# EAGLE design BreakoutBoard_RevA (EAGLE 6.0)
AUTHOR: Sandor Szilvasi; AUTHOREMAIL: sandor.szilvasi@vanderbilt.edu; COPYRIGHT: Copyright © 2011 Vanderbilt University, ISIS; PAGE1: Cover Page; PAGE2: General Breakout; PAGE3: Power Board Specific; REVISION: A; TITLE: Breakout Board; VERIFIER: Peter Volgyesi; VERIFIEREMAIL: peter.volgyesi@vanderbilt.edu

## Sheet 1 of 3
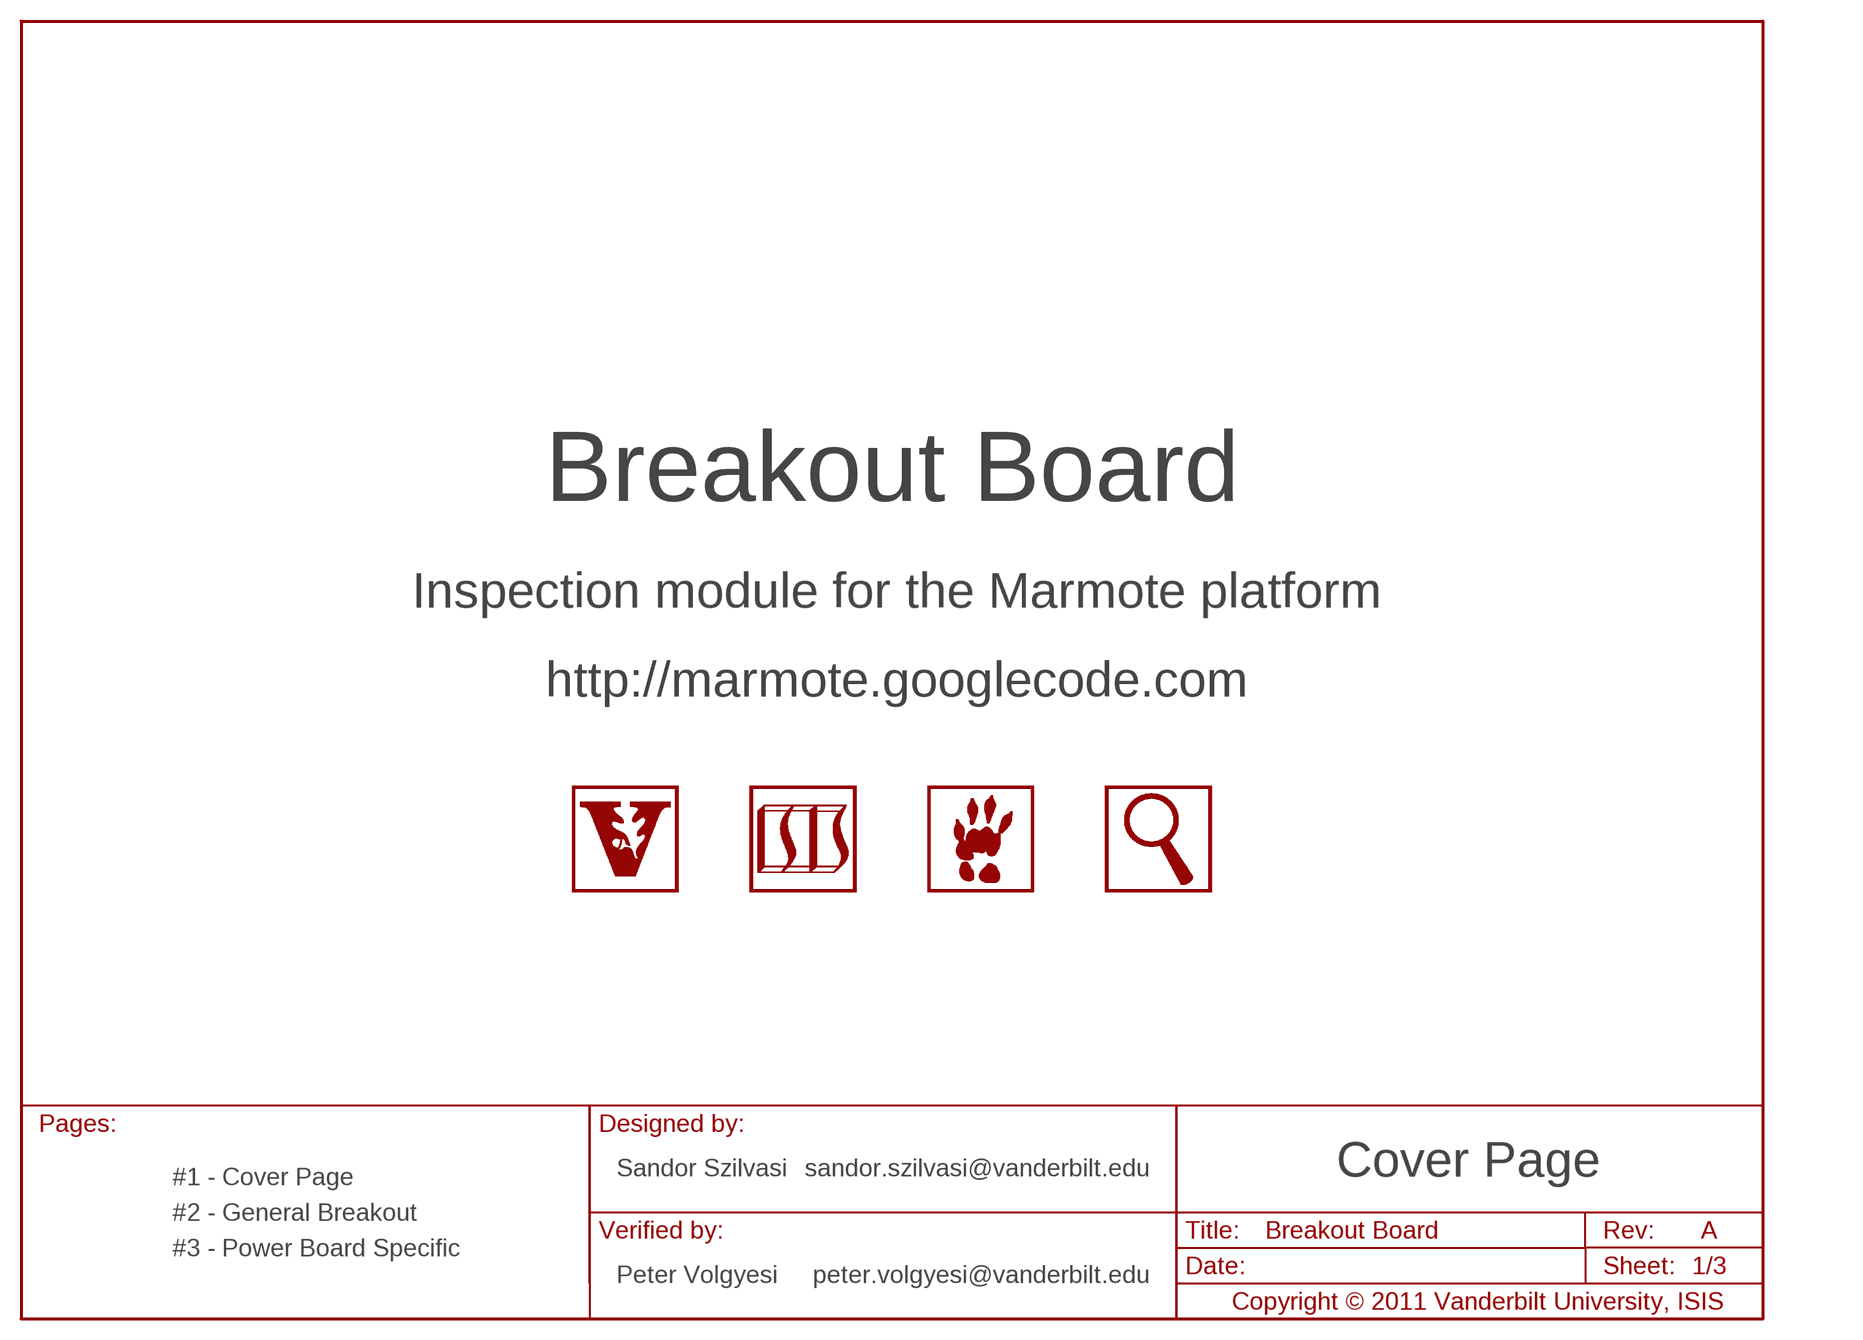
[diagram p0: schematic, sheet 1]

### Parts
LOGO1  LOGO-ISIS-600MIL-10MM-AU  [LOGO-ISIS-10MM-GOLD]
LOGO2  LOGO-VANDERBILT-600MIL-10MM-AU  [LOGO-VANDERBILT-10MM-GOLD]
LOGO3  LOGO-MARMOTE-600MIL-10MM-AU  [LOGO-MARMOTE-10MM-GOLD]
LOGO4  LOGO-MAGNIFYING-GLASS-600MIL-10MM-AU  [LOGO-MAGNIFYING-GLASS-10MM-GOLD]

### Notes on the sheet
- Inspection module for the Marmote platform
- http://marmote.googlecode.com

## Sheet 2 of 3
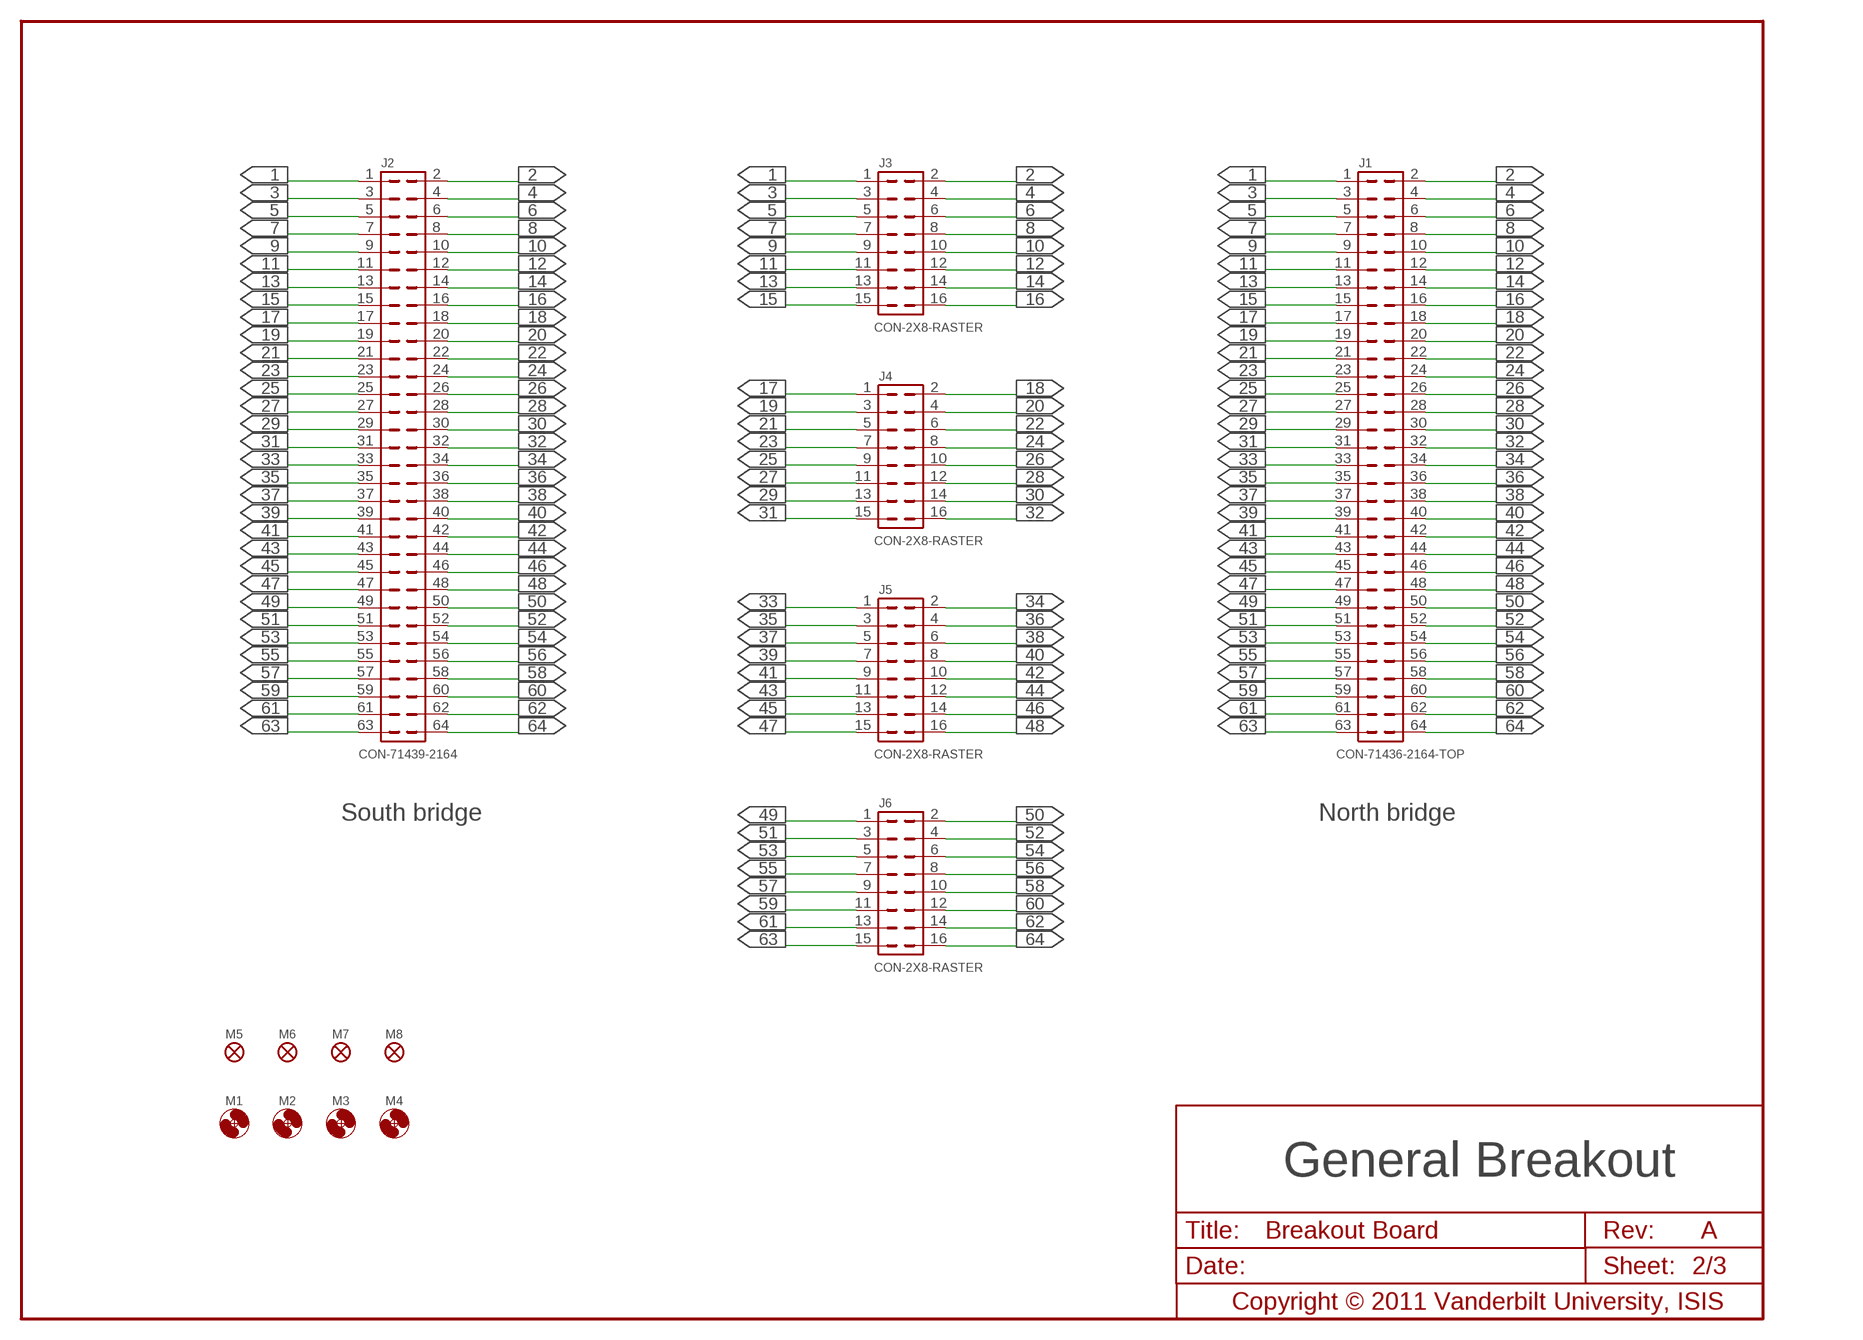
[diagram p1: schematic, sheet 2]

### Parts
J1  CON-71436-2164-TOP  [71436-XX64]
J2  CON-71439-2164  [71439-XX64-BOT]
J3  CON-2X8-RASTER  [2X16]
J4  CON-2X8-RASTER  [2X16]
J5  CON-2X8-RASTER  [2X16]
J6  CON-2X8-RASTER  [2X16]
M1  MOUNT-HOLE3.3  [3,3]
M2  MOUNT-HOLE3.3  [3,3]
M3  MOUNT-HOLE3.3  [3,3]
M4  MOUNT-HOLE3.3  [3,3]
M5  FIDUCIAL1X2  [FIDUCIAL-1X2]
M6  FIDUCIAL1X2  [FIDUCIAL-1X2]
M7  FIDUCIAL1X2  [FIDUCIAL-1X2]
M8  FIDUCIAL1X2  [FIDUCIAL-1X2]

### Nets
1: J1.1 J2.1 J3.1 ; also sheet 3
2: J1.2 J2.2 J3.2 ; also sheet 3
3: J1.3 J2.3 J3.3
4: J1.4 J2.4 J3.4 ; also sheet 3
5: J1.5 J2.5 J3.5
6: J1.6 J2.6 J3.6 ; also sheet 3
7: J1.7 J2.7 J3.7
8: J1.8 J2.8 J3.8 ; also sheet 3
9: J1.9 J2.9 J3.9
10: J1.10 J2.10 J3.10
11: J1.11 J2.11 J3.11
12: J1.12 J2.12 J3.12
13: J1.13 J2.13 J3.13
14: J1.14 J2.14 J3.14
15: J1.15 J2.15 J3.15
16: J1.16 J2.16 J3.16
17: J1.17 J2.17 J4.1
18: J1.18 J2.18 J4.2
19: J1.19 J2.19 J4.3
20: J1.20 J2.20 J4.4
21: J1.21 J2.21 J4.5
22: J1.22 J2.22 J4.6
23: J1.23 J2.23 J4.7
24: J1.24 J2.24 J4.8
25: J1.25 J2.25 J4.9
26: J1.26 J2.26 J4.10
27: J1.27 J2.27 J4.11
28: J1.28 J2.28 J4.12
29: J1.29 J2.29 J4.13
30: J1.30 J2.30 J4.14 ; also sheet 3
31: J1.31 J2.31 J4.15
32: J1.32 J2.32 J4.16 ; also sheet 3
33: J1.33 J2.33 J5.1
34: J1.34 J2.34 J5.2 ; also sheet 3
35: J1.35 J2.35 J5.3
36: J1.36 J2.36 J5.4 ; also sheet 3
37: J1.37 J2.37 J5.5
38: J1.38 J2.38 J5.6 ; also sheet 3
39: J1.39 J2.39 J5.7
40: J1.40 J2.40 J5.8
41: J1.41 J2.41 J5.9
42: J1.42 J2.42 J5.10
43: J1.43 J2.43 J5.11
44: J1.44 J2.44 J5.12
45: J1.45 J2.45 J5.13
46: J1.46 J2.46 J5.14
47: J1.47 J2.47 J5.15
48: J1.48 J2.48 J5.16
49: J1.49 J2.49 J6.1
50: J1.50 J2.50 J6.2
51: J1.51 J2.51 J6.3
52: J1.52 J2.52 J6.4
53: J1.53 J2.53 J6.5
54: J1.54 J2.54 J6.6
55: J1.55 J2.55 J6.7
56: J1.56 J2.56 J6.8
57: J1.57 J2.57 J6.9
58: J1.58 J2.58 J6.10
59: J1.59 J2.59 J6.11
60: J1.60 J2.60 J6.12 ; also sheet 3
61: J1.61 J2.61 J6.13
62: J1.62 J2.62 J6.14 ; also sheet 3
63: J1.63 J2.63 J6.15 ; also sheet 3
64: J1.64 J2.64 J6.16 ; also sheet 3

### Notes on the sheet
- South bridge | North bridge

## Sheet 3 of 3
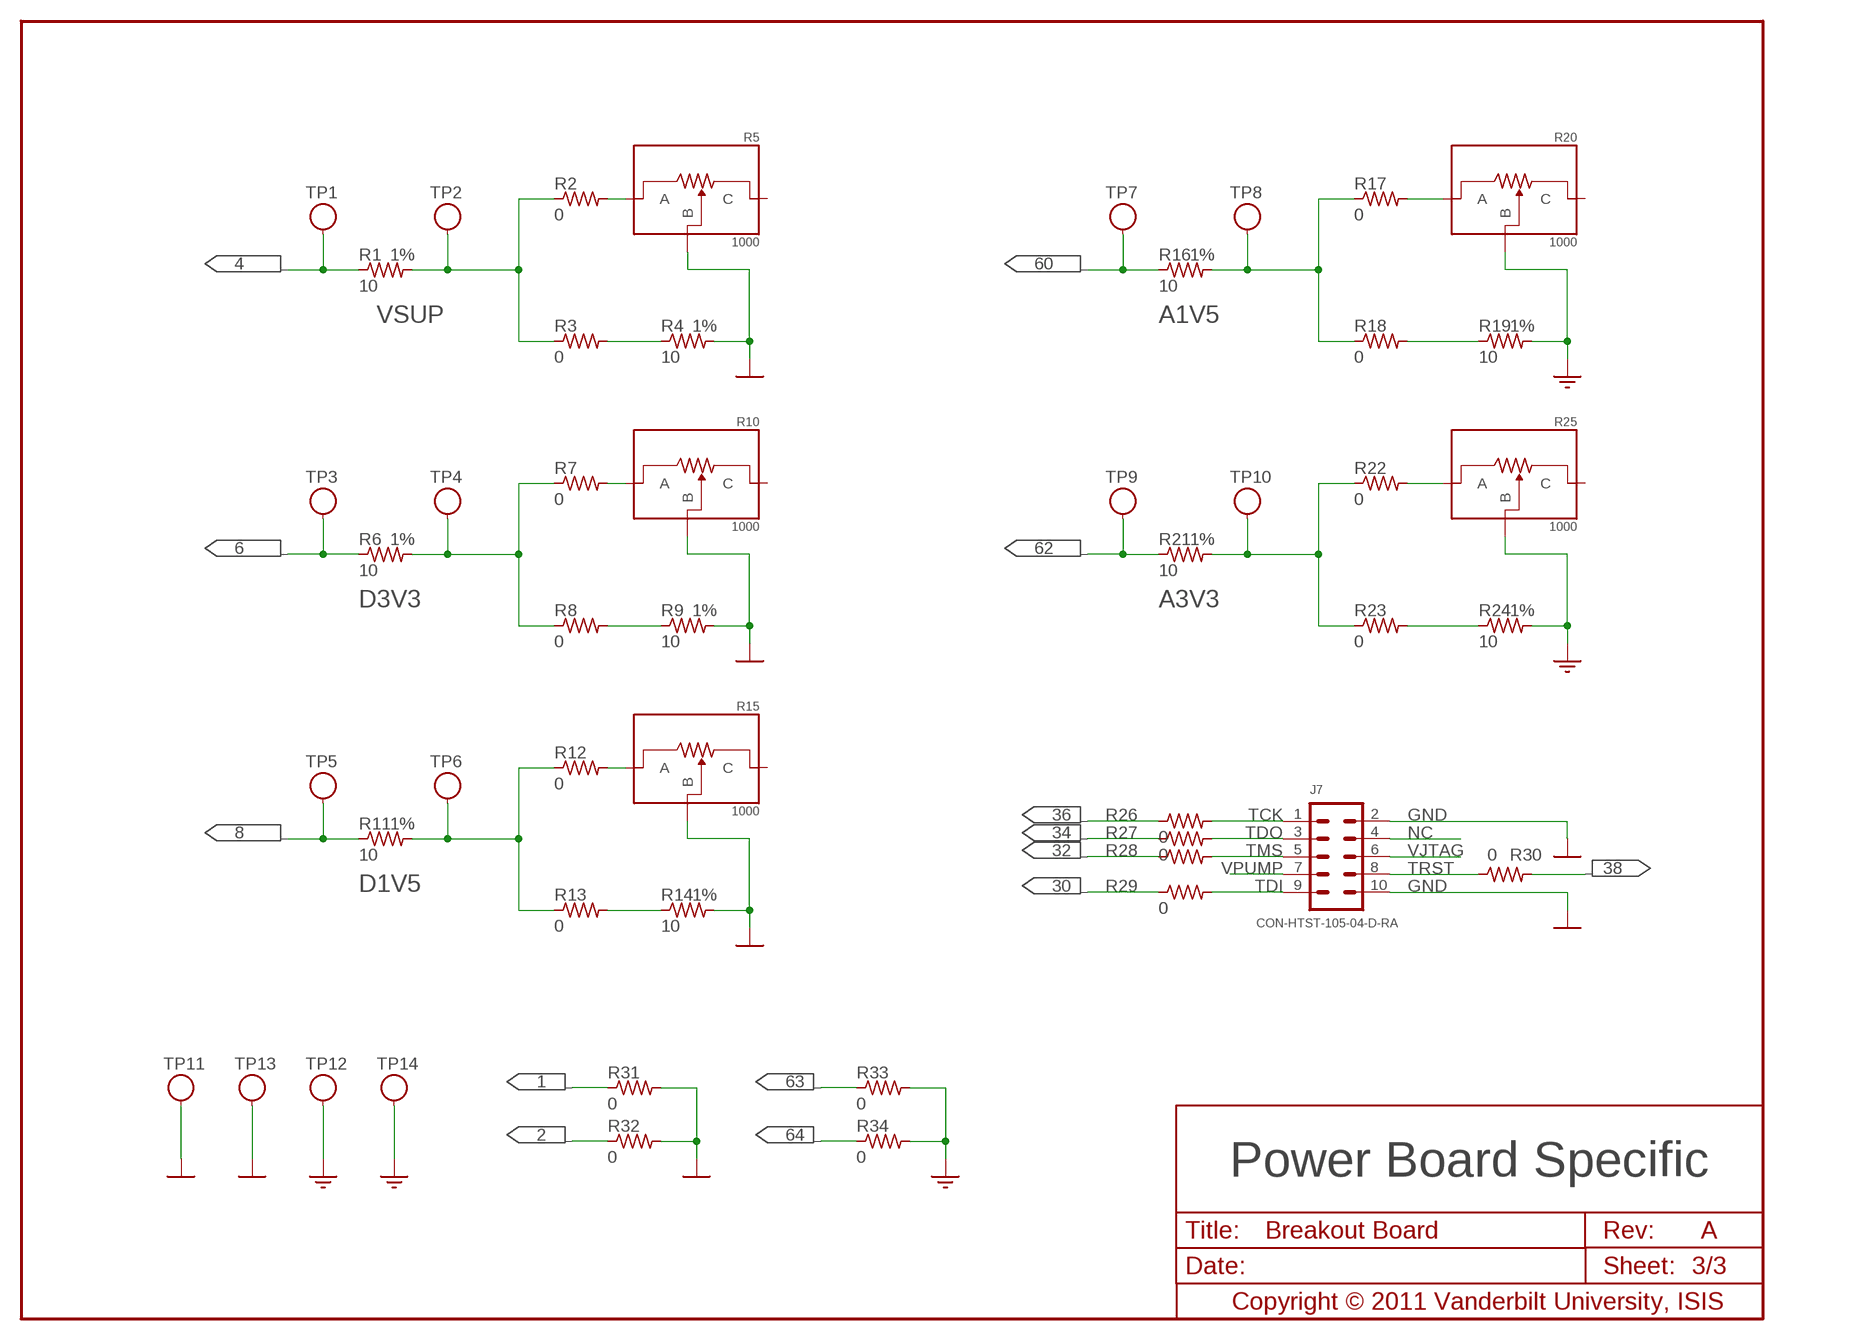
[diagram p2: schematic, sheet 3]

### Parts
J7  CON-HTST-105-04-D-RA  [HTST-105-04-D-RA]
R1  10  R0805  [R0805]
R2  0  R0805  [R0805]
R3  0  R0805  [R0805]
R4  10  R0805  [R0805]
R5  1000  TRIMMER  [TRIMMER-3MM]
R6  10  R0805  [R0805]
R7  0  R0805  [R0805]
R8  0  R0805  [R0805]
R9  10  R0805  [R0805]
R10  1000  TRIMMER  [TRIMMER-3MM]
R11  10  R0805  [R0805]
R12  0  R0805  [R0805]
R13  0  R0805  [R0805]
R14  10  R0805  [R0805]
R15  1000  TRIMMER  [TRIMMER-3MM]
R16  10  R0805  [R0805]
R17  0  R0805  [R0805]
R18  0  R0805  [R0805]
R19  10  R0805  [R0805]
R20  1000  TRIMMER  [TRIMMER-3MM]
R21  10  R0805  [R0805]
R22  0  R0805  [R0805]
R23  0  R0805  [R0805]
R24  10  R0805  [R0805]
R25  1000  TRIMMER  [TRIMMER-3MM]
R26  0  R0805  [R0805]
R27  0  R0805  [R0805]
R28  0  R0805  [R0805]
R29  0  R0805  [R0805]
R30  0  R0805  [R0805]
R31  0  R0805  [R0805]
R32  0  R0805  [R0805]
R33  0  R0805  [R0805]
R34  0  R0805  [R0805]
TP1  TESTPOINT-BLUE  [TESTPOINT]
TP2  TESTPOINT-BLUE  [TESTPOINT]
TP3  TESTPOINT-BLUE  [TESTPOINT]
TP4  TESTPOINT-BLUE  [TESTPOINT]
TP5  TESTPOINT-BLUE  [TESTPOINT]
TP6  TESTPOINT-BLUE  [TESTPOINT]
TP7  TESTPOINT-GREEN  [TESTPOINT]
TP8  TESTPOINT-GREEN  [TESTPOINT]
TP9  TESTPOINT-GREEN  [TESTPOINT]
TP10  TESTPOINT-GREEN  [TESTPOINT]
TP11  TESTPOINT-YELLOW  [TESTPOINT]
TP12  TESTPOINT-YELLOW  [TESTPOINT]
TP13  TESTPOINT-YELLOW  [TESTPOINT]
TP14  TESTPOINT-YELLOW  [TESTPOINT]

### Nets
1: R31.1 ; also sheet 2
2: R32.1 ; also sheet 2
4: R1.1 TP1.1 ; also sheet 2
6: R6.1 TP3.1 ; also sheet 2
8: R11.1 TP5.1 ; also sheet 2
30: R29.1 ; also sheet 2
32: R28.1 ; also sheet 2
34: R27.1 ; also sheet 2
36: R26.1 ; also sheet 2
38: R30.2 ; also sheet 2
60: R16.1 TP7.1 ; also sheet 2
62: R21.1 TP9.1 ; also sheet 2
63: R33.1 ; also sheet 2
64: R34.1 ; also sheet 2
A1V5-: R16.2 R17.1 R18.1 TP8.1
A3V3-: R21.2 R22.1 R23.1 TP10.1
AGND: R19.2 R20.2(B) R24.2 R25.2(B) R33.2 R34.2 TP12.1 TP14.1
D1V5-: R11.2 R12.1 R13.1 TP6.1
D3V3-: R6.2 R7.1 R8.1 TP4.1
DGND: J7.2 J7.10 R4.2 R5.2(B) R9.2 R10.2(B) R14.2 R15.2(B) R31.2 R32.2 TP11.1 TP13.1
N$4: R7.2 R10.1(A)
N$5: R8.2 R9.1
N$8: R12.2 R15.1(A)
N$9: R18.2 R19.1
N$10: R17.2 R20.1(A)
N$11: R22.2 R25.1(A)
N$13: R2.2 R5.1(A)
N$14: R3.2 R4.1
N$15: R13.2 R14.1
N$16: R23.2 R24.1
NC: J7.4
TCK: J7.1 R26.2
TDI: J7.9 R29.2
TDO: J7.3 R27.2
TMS: J7.5 R28.2
TRST: J7.8 R30.1
VJTAG: J7.6
VPUMP: J7.7
VSUP-: R1.2 R2.1 R3.1 TP2.1
Unconnected: R5.3(C) R10.3(C) R15.3(C) R20.3(C) R25.3(C)

### Notes on the sheet
- VSUP | A1V5
- D3V3 | A3V3
- GND
- D1V5 | GND

## Library data of the parts
J1 = BreakoutBoard:CON-71436: Board-to-Board Connector 1.00mm (.039") Mezzanine IEEE 1386 Plug - Dual Row 64-pin, SMT, Vertical Stacking Source: http://www.molex.com/product/micro/71436.html; DIGI-KEY#: WM17200-ND; MF: Molex; MPN: 71436-2164
J2 = BreakoutBoard:CON-71439: Board-to-Board Connector 1.00mm (.039") Mezzanine IEEE 1386 Receptacle - Dual Row 64-pin, SMT, Vertical Stacking Source: http://www.molex.com/molex/products/datasheet.jsp?part=active/0714392164_PCB_RECEPTACLES.xml&channel=Products; DIGI-KEY#: WM17222-ND; MATED-STACKING-HEIGHT: 13mm; MF: Molex; MPN: 71439-2164
J3-J6 = BreakoutBoard:CON-2X8-RASTER
J7 = BreakoutBoard:CON-HTST-105-04: 2x5 pin Through-hole .025" SQ Post Header Source: Datasheet <http://media.digikey.com/PDF/Data%20Sheets/Samtec/TSS,TST,HTSS,HTST,ZSS,ZST_Series.pdf>
LOGO1 = Logo:LOGO-ISIS-600MIL: ISIS Logo Official logo of the Institute for Software Integrated Systems (ISIS), Vanderbilt as of 2011 Generated from 360 x 360 px bitmap and scaled to 600 x 600 mil v1.0 Initial design
LOGO2 = Logo:LOGO-VANDERBILT-600MIL: Vanderbilt Logo Official Framed Vanderbilt Logo Generated from 360 x 360 px bitmap and scaled to 600 x 600 mil v1.1 Source bitmap smoothened v1.0 Initial design
LOGO3 = Logo:LOGO-MARMOTE-600MIL: Marmote Platform Logo Preliminary logo for the Marmote Platform (http://marmote.googlecode.com) Generated from 360 x 360 px bitmap and scaled to 600 x 600 mil v1.1 Source bitmap smoothened v1.0 Initial design
LOGO4 = Logo:LOGO-MAGNIFYING-GLASS-600MIL: Magnifying Glass Logo Logo for the breakout board of the Marmote platform. Generated from 360 x 360 px bitmap and scaled to 600 x 600 mil. v1.0 Initial design
M1-M4 = powerboard:MOUNT-HOLE: MOUNTING HOLE with drill center marker
M5-M8 = powerboard:FIDUCIAL: Fiducial Alignment Points Various fiducial points for machine vision alignment.
R1 R4 R6 R9 R11 R14 R16 R19 R21 R24 = BreakoutBoard:R: RESISTOR; TOLERANCE: 1%
R2 R3 R7 R8 R12 R13 R17 R18 R22 R23 R26-R34 = BreakoutBoard:R: RESISTOR
R5 R10 R15 R20 R25 = BreakoutBoard:TRIMMER: Panasonic EVM series SMT trimmer; DIGI-KEY#: P3W102CT-ND; MF: Panasonic - ECG; MPN: EVM-3WSX80B13
TP1-TP6 = BreakoutBoard:TESTPOINT: Test Point Keystone compact through hole mount test point for SUPPLY and GROUND signals Terminal: .015 (.38) × .032 (.81) thick Phosphor Bronze Wire, Silver Plate Base: Nylon 46, UL Rated 94V-0 Mtg. Hole: .063 (1.6) Diameter Source: http://www.keyelco.com/pdfs/M55p51.pdf; DIGI-KEY#: 5122K-ND; MF: Keystone; MPN: 5122
TP7-TP10 = BreakoutBoard:TESTPOINT: Test Point Keystone compact through hole mount test point for SUPPLY and GROUND signals Terminal: .015 (.38) × .032 (.81) thick Phosphor Bronze Wire, Silver Plate Base: Nylon 46, UL Rated 94V-0 Mtg. Hole: .063 (1.6) Diameter Source: http://www.keyelco.com/pdfs/M55p51.pdf; DIGI-KEY#: 5121K-ND; MF: Keystone; MPN: 5121
TP11-TP14 = BreakoutBoard:TESTPOINT: Test Point Keystone compact through hole mount test point for SUPPLY and GROUND signals Terminal: .015 (.38) × .032 (.81) thick Phosphor Bronze Wire, Silver Plate Base: Nylon 46, UL Rated 94V-0 Mtg. Hole: .063 (1.6) Diameter Source: http://www.keyelco.com/pdfs/M55p51.pdf; DIGI-KEY#: 5009K-ND; MF: Keystone; MPN: 5009

## Board
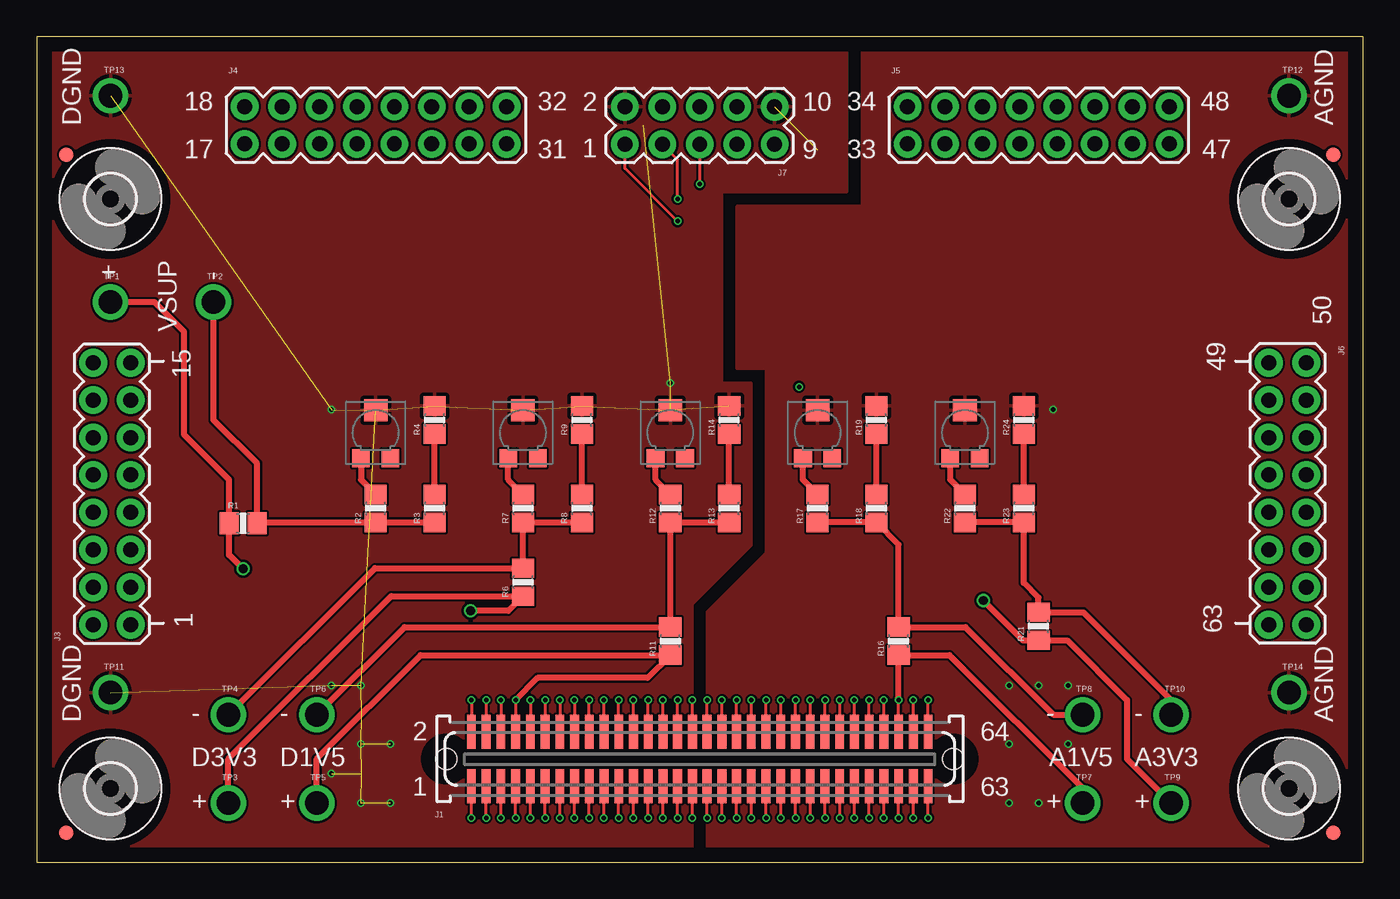
[diagram p3: board, top side]
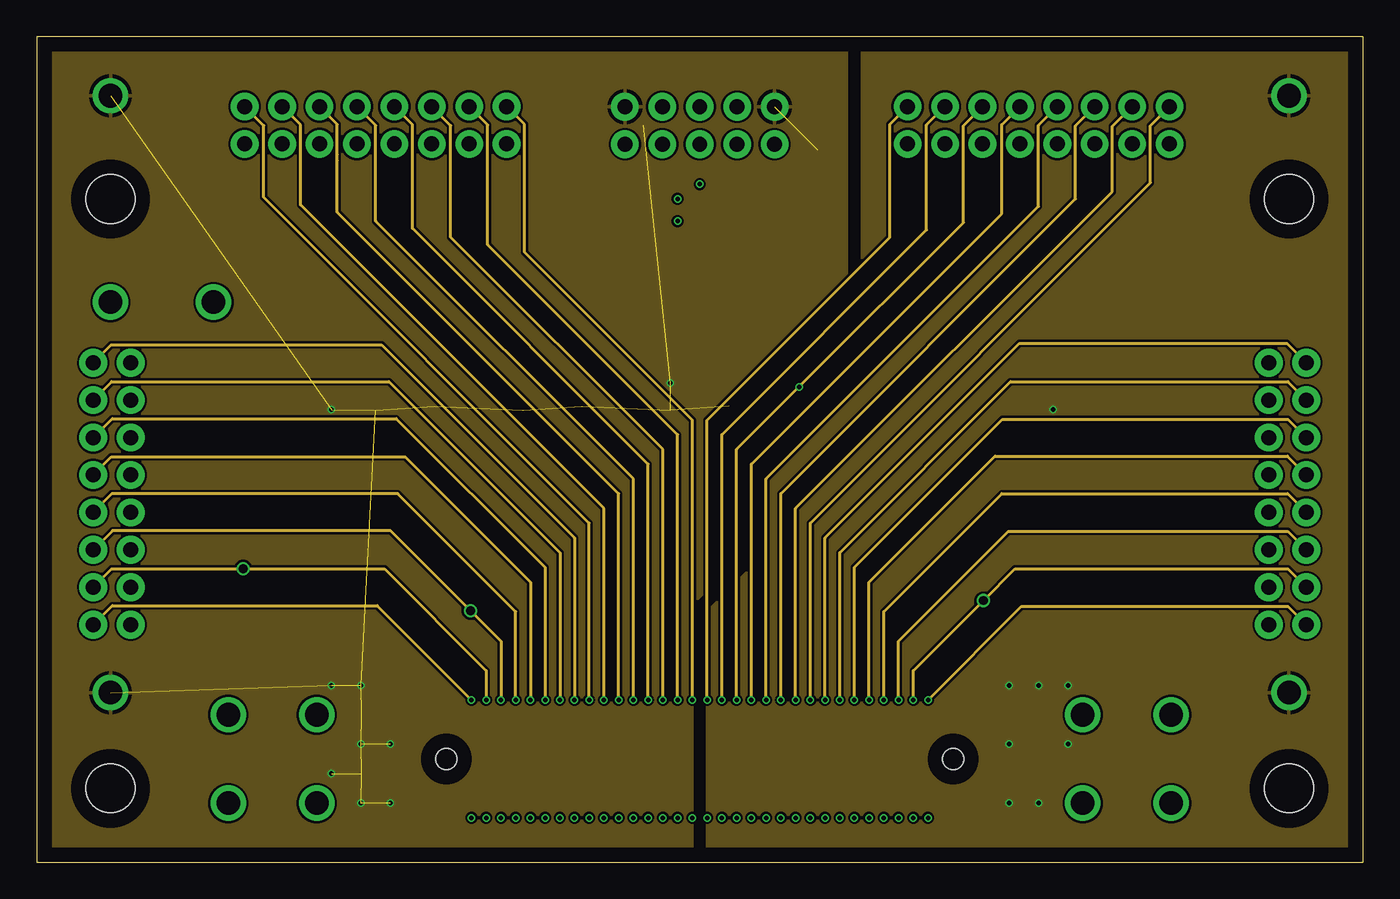
[diagram p4: board, inner layer Even]
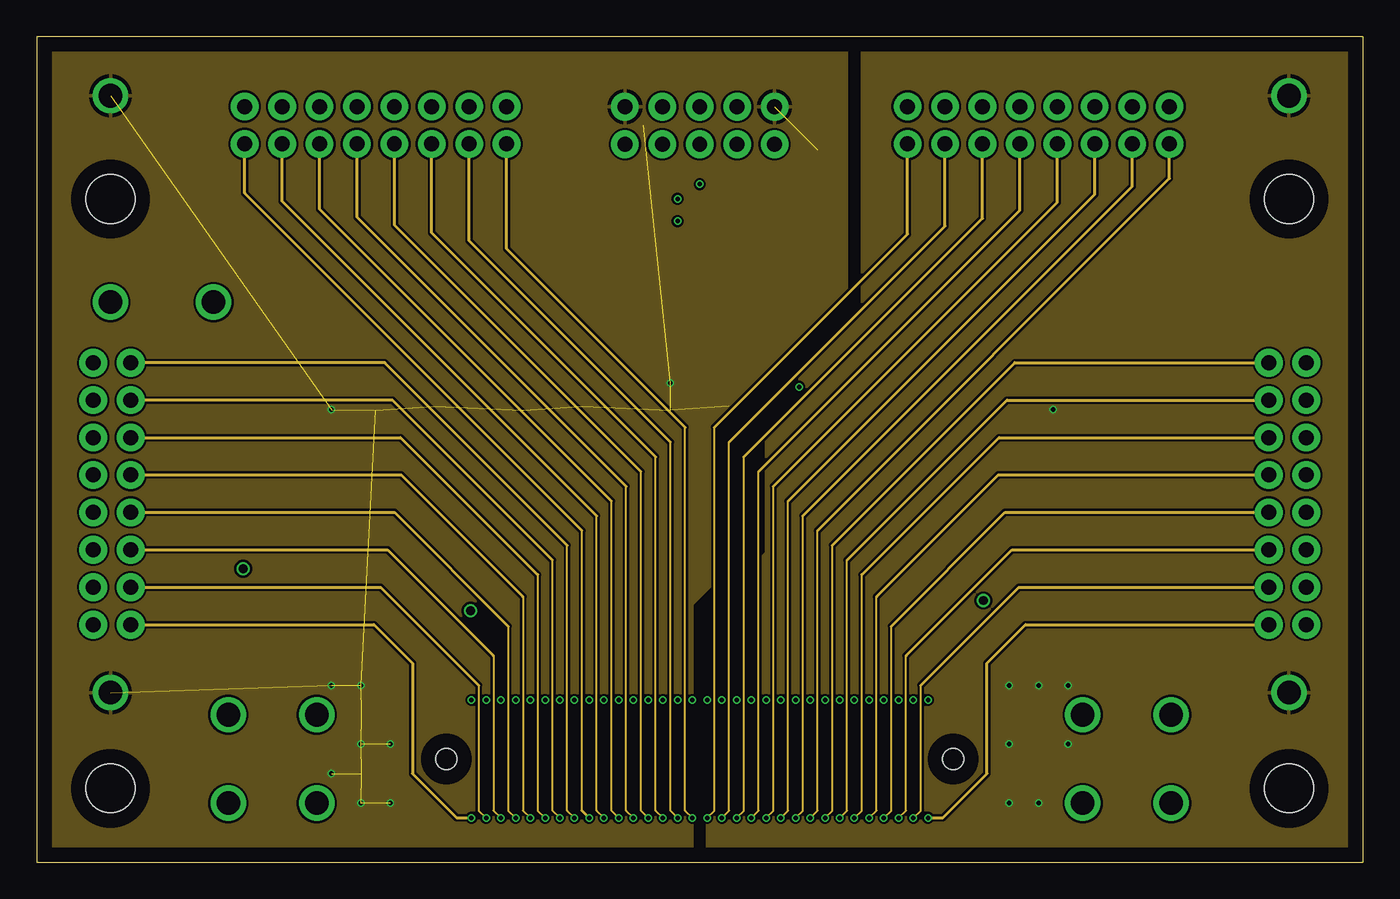
[diagram p5: board, inner layer Odd]
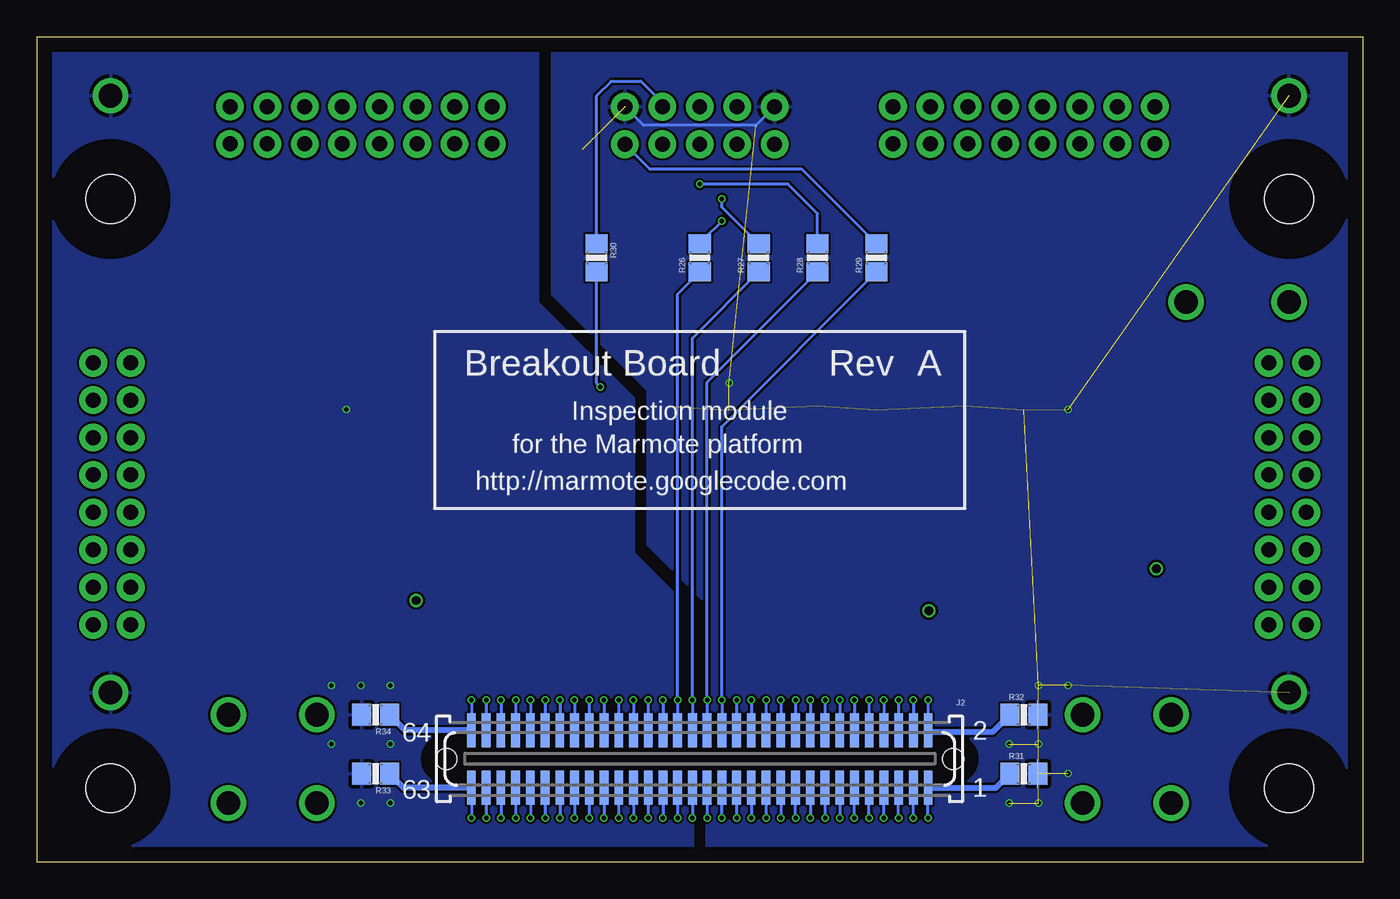
[diagram p6: board, bottom side, seen from below]

Size 90 x 56 mm. Coordinates in mm from the lower left corner, seen from the top.
Outline: 0,56 0,0 90,0 90,56 0,56
Copper layers (1*2+3*16): Top 0.0356mm / dielectric 8mil / Even 0.0356mm / dielectric 39mil / Odd 0.0356mm / dielectric 8mil / Bottom 0.0356mm
Design rules: minimum track width 6mil, minimum drill 12mil, track to track 6mil, track to pad 6mil, pad to pad 6mil, via to via 6mil, smd to smd 6mil, copper to edge 40mil, drill to drill 8mil, minimum pad ring 10mil, minimum via ring 4mil, stop-mask expansion 0mil, vias tented up to drill 8mil, thermal gap 10mil

### Footprints (pad centres in the part's own frame; a part is rotated, then mirrored left to right if it is on the bottom)
71436-XX64 = smd 0.6 x 2.3: 1 -15.5,-1.85; 2 -15.5,1.85; 3 -14.5,-1.85; 4 -14.5,1.85; 5 -13.5,-1.85; 6 -13.5,1.85; 7 -12.5,-1.85; 8 -12.5,1.85; 9 -11.5,-1.85; 10 -11.5,1.85; 11 -10.5,-1.85; 12 -10.5,1.85; 13 -9.5,-1.85; 14 -9.5,1.85; 15 -8.5,-1.85; 16 -8.5,1.85; 17 -7.5,-1.85; 18 -7.5,1.85; 19 -6.5,-1.85; 20 -6.5,1.85; 21 -5.5,-1.85; 22 -5.5,1.85; 23 -4.5,-1.85; 24 -4.5,1.85; 25 -3.5,-1.85; 26 -3.5,1.85; 27 -2.5,-1.85; 28 -2.5,1.85; 29 -1.5,-1.85; 30 -1.5,1.85; 31 -0.5,-1.85; 32 -0.5,1.85; 33 0.5,-1.85; 34 0.5,1.85; 35 1.5,-1.85; 36 1.5,1.85; 37 2.5,-1.85; 38 2.5,1.85; 39 3.5,-1.85; 40 3.5,1.85; 41 4.5,-1.85; 42 4.5,1.85; 43 5.5,-1.85; 44 5.5,1.85; 45 6.5,-1.85; 46 6.5,1.85; 47 7.5,-1.85; 48 7.5,1.85; 49 8.5,-1.85; 50 8.5,1.85; 51 9.5,-1.85; 52 9.5,1.85; 53 10.5,-1.85; 54 10.5,1.85; 55 11.5,-1.85; 56 11.5,1.85; 57 12.5,-1.85; 58 12.5,1.85; 59 13.5,-1.85; 60 13.5,1.85; 61 14.5,-1.85; 62 14.5,1.85; 63 15.5,-1.85; 64 15.5,1.85 | hole 1.4: -17.2,0; 17.2,0
71439-XX64-BOT = smd 0.6 x 2.3: 1 -15.5,1.96; 2 -15.5,-1.96; 3 -14.5,1.96; 4 -14.5,-1.96; 5 -13.5,1.96; 6 -13.5,-1.96; 7 -12.5,1.96; 8 -12.5,-1.96; 9 -11.5,1.96; 10 -11.5,-1.96; 11 -10.5,1.96; 12 -10.5,-1.96; 13 -9.5,1.96; 14 -9.5,-1.96; 15 -8.5,1.96; 16 -8.5,-1.96; 17 -7.5,1.96; 18 -7.5,-1.96; 19 -6.5,1.96; 20 -6.5,-1.96; 21 -5.5,1.96; 22 -5.5,-1.96; 23 -4.5,1.96; 24 -4.5,-1.96; 25 -3.5,1.96; 26 -3.5,-1.96; 27 -2.5,1.96; 28 -2.5,-1.96; 29 -1.5,1.96; 30 -1.5,-1.96; 31 -0.5,1.96; 32 -0.5,-1.96; 33 0.5,1.96; 34 0.5,-1.96; 35 1.5,1.96; 36 1.5,-1.96; 37 2.5,1.96; 38 2.5,-1.96; 39 3.5,1.96; 40 3.5,-1.96; 41 4.5,1.96; 42 4.5,-1.96; 43 5.5,1.96; 44 5.5,-1.96; 45 6.5,1.96; 46 6.5,-1.96; 47 7.5,1.96; 48 7.5,-1.96; 49 8.5,1.96; 50 8.5,-1.96; 51 9.5,1.96; 52 9.5,-1.96; 53 10.5,1.96; 54 10.5,-1.96; 55 11.5,1.96; 56 11.5,-1.96; 57 12.5,1.96; 58 12.5,-1.96; 59 13.5,1.96; 60 13.5,-1.96; 61 14.5,1.96; 62 14.5,-1.96; 63 15.5,1.96; 64 15.5,-1.96 | hole 1.4: -17.2,0; 17.2,0
2X16 = drill 1.016 pad 1.88: 1 -8.89,-1.27; 2 -8.89,1.27; 3 -6.35,-1.27; 4 -6.35,1.27; 5 -3.81,-1.27; 6 -3.81,1.27; 7 -1.27,-1.27; 8 -1.27,1.27; 9 1.27,-1.27; 10 1.27,1.27; 11 3.81,-1.27; 12 3.81,1.27; 13 6.35,-1.27; 14 6.35,1.27; 15 8.89,-1.27; 16 8.89,1.27
HTST-105-04-D-RA = drill 1.016 pad 1.88: 1 5.08,2.54; 2 5.08,0; 3 2.54,2.54; 4 2.54,0; 5 0,2.54; 6 0,0; 7 -2.54,2.54; 8 -2.54,0; 9 -5.08,2.54; 10 -5.08,0
3,3 = hole 3.3: 0,0
FIDUCIAL-1X2 = smd 1 x 1: 1 0,0
R0805 = smd 1.3 x 1.5: 1 -0.95,0; 2 0.95,0
TRIMMER-3MM = smd 1.2 x 1.2: 1 -1,-1.6; 3 1,-1.6 | smd 1.6 x 1.5: 2 0,1.65
TESTPOINT = drill 1.6: 1 0,0

### Placement (x,y rotation side)
J1  45,7 0 top
J2  45,7 180 bottom
J3  5.1,25 90 top
J4  23,50 0 top
J5  68,50 0 top
J6  84.9,25 270 top
J7  45,51.25 180 top
LOGO1  32,34 0 top
LOGO2  16,34 0 top
LOGO3  48,34 0 top
LOGO4  64,34 0 top
M1  5,5 0 top
M2  5,45 0 top
M3  85,45 0 top
M4  85,5 0 top
M5  2,2 0 top
M6  2,48 0 top
M7  88,48 0 top
M8  88,2 0 top
R1  14,23 0 top
R2  23,24 90 top
R3  27,24 90 top
R4  27,30 90 top
R5  23,29 0 top
R6  33,19 90 top
R7  33,24 90 top
R8  37,24 90 top
R9  37,30 90 top
R10  33,29 0 top
R11  43,15 90 top
R12  43,24 90 top
R13  47,24 90 top
R14  47,30 90 top
R15  43,29 0 top
R16  58.5,15 90 top
R17  53,24 90 top
R18  57,24 90 top
R19  57,30 90 top
R20  53,29 0 top
R21  68,16 90 top
R22  63,24 90 top
R23  67,24 90 top
R24  67,30 90 top
R25  63,29 0 top
R26  45,41 90 bottom
R27  41,41 90 bottom
R28  37,41 90 bottom
R29  33,41 90 bottom
R30  52,41 270 bottom
R31  23,6 0 bottom
R32  23,10 0 bottom
R33  67,6 180 bottom
R34  67,10 180 bottom
TP1  5,38 0 top
TP2  12,38 0 top
TP3  13,4 0 top
TP4  13,10 0 top
TP5  19,4 0 top
TP6  19,10 0 top
TP7  71,4 0 top
TP8  71,10 0 top
TP9  77,4 0 top
TP10  77,10 0 top
TP11  5,11.5 0 top
TP12  85,52 0 top
TP13  5,52 0 top
TP14  85,11.5 0 top

### Tracks (layer width: path | path; a pad name or v marks a point on that pad's centre or on a via)
1  (via drill 0.3)
  Top 0.203: v29.5,3 J1.1
  Odd 0.203: J3.1 22.89,16.11 25.5,13.5 25.5,6 28.5,3 v29.5,3
  Bottom 0.203: v29.5,3 J2.1
  Bottom 0.406: R31.1 24.91,5.04 J2.1
2  (via drill 0.3)
  Top 0.203: v29.5,11 J1.2
  Even 0.203: J3.2 5.12,17.4 23.1,17.4 v29.5,11
  Bottom 0.203: v29.5,11 J2.2
  Bottom 0.406: R32.1 25.1,8.85 J1.2 J2.2
3  (via drill 0.3)
  Top 0.203: v30.5,3 J1.3
  Odd 0.152: v30.5,3 30,3.5 30,12
  Odd 0.203: J3.3 23.35,18.65 30,12
  Bottom 0.203: v30.5,3 J2.3
4  (via drill 0.3, 0.6)
  Top 0.203: v30.5,11 J1.4
  Top 0.406: TP1.1 8,38 10,36 10,29 13.05,25.95 R1.1 13.05,20.85 v14,19.9
  Even 0.203: J3.4 5.08,19.9 v14,19.9 23.6,19.9 30.5,13 v30.5,11
  Bottom 0.203: v30.5,11 J2.4
5  (via drill 0.3)
  Top 0.203: v31.5,3 J1.5
  Odd 0.152: v31.5,3 31,3.5 31,14
  Odd 0.203: J3.5 23.81,21.19 31,14
  Bottom 0.203: v31.5,3 J2.5
6  (via drill 0.3, 0.6)
  Top 0.203: v31.5,11 J1.6
  Top 0.406: TP3.1 13,7 24.05,18.05 R6.1 32,17.05 v29.45,17.05
  Even 0.203: J3.6 5.14,22.5 24,22.5 v29.45,17.05 31.5,15 v31.5,11
  Bottom 0.203: v31.5,11 J2.6
7  (via drill 0.3)
  Top 0.203: v32.5,3 J1.7
  Odd 0.152: v32.5,3 32,3.5 32,16
  Odd 0.203: J3.7 24.27,23.73 32,16
  Bottom 0.203: v32.5,3 J2.7
8  (via drill 0.3)
  Top 0.203: v32.5,11 J1.8
  Top 0.406: v32.5,11 34,12.5 41.45,12.5 R11.1 26.05,14.05 19,7 TP5.1
  Even 0.203: J3.8 5.1,25 24.5,25 32.5,17 v32.5,11
  Bottom 0.203: v32.5,11 J2.8
9  (via drill 0.3)
  Top 0.203: v33.5,3 J1.9
  Odd 0.152: v33.5,3 33,3.5 33,18
  Odd 0.203: 33,18 24.73,26.27 J3.9
  Bottom 0.203: v33.5,3 J2.9
10  (via drill 0.3)
  Top 0.203: v33.5,11 J1.10
  Even 0.203: J3.10 5.06,27.5 25,27.5 33.5,19 v33.5,11
  Bottom 0.203: v33.5,11 J2.10
11  (via drill 0.3)
  Top 0.203: v34.5,3 J1.11
  Odd 0.152: v34.5,3 34,3.5 34,19.5
  Odd 0.203: 34,19.5 24.69,28.81 J3.11
  Bottom 0.203: v34.5,3 J2.11
12  (via drill 0.3)
  Top 0.203: v34.5,11 J1.12
  Even 0.203: J3.12 5.12,30.1 24.4,30.1 34.5,20 v34.5,11
  Bottom 0.203: v34.5,11 J2.12
13  (via drill 0.3)
  Top 0.203: v35.5,3 J1.13
  Odd 0.152: v35.5,3 35,3.5 35,20.5
  Odd 0.203: 35,20.5 24.15,31.35 J3.13
  Bottom 0.203: J2.13 v35.5,3
14  (via drill 0.3)
  Top 0.203: v35.5,11 J1.14
  Even 0.203: J3.14 5.08,32.6 23.9,32.6 35.5,21 v35.5,11
  Bottom 0.203: v35.5,11 J2.14
15  (via drill 0.3)
  Top 0.203: v36.5,3 J1.15
  Odd 0.152: v36.5,3 36,3.5 36,21.5
  Odd 0.203: 36,21.5 23.61,33.89 J3.15
  Bottom 0.203: J2.15 v36.5,3
16  (via drill 0.3)
  Top 0.203: v36.5,11 J1.16
  Even 0.203: J3.16 5.04,35.1 23.4,35.1 36.5,22 v36.5,11
  Bottom 0.203: v36.5,11 J2.16
17  (via drill 0.3)
  Top 0.203: v37.5,3 J1.17
  Odd 0.152: 37,3.5 37,22.5
  Odd 0.203: v37.5,3 37,3.5 | 37,22.5 14.11,45.39 J4.1
  Bottom 0.203: J2.17 v37.5,3
18  (via drill 0.3)
  Top 0.203: J1.18 v37.5,11
  Even 0.203: v37.5,11 37.5,23 15.4,45.1 15.4,49.98 J4.2
  Bottom 0.203: v37.5,11 J2.18
19  (via drill 0.3)
  Top 0.203: v38.5,3 J1.19
  Odd 0.152: v38.5,3 38,3.5 38,23.5
  Odd 0.203: 38,23.5 16.65,44.85 J4.3
  Bottom 0.203: v38.5,3 J2.19
20  (via drill 0.3)
  Top 0.203: J1.20 v38.5,11
  Even 0.203: v38.5,11 38.5,24 17.9,44.6 17.9,50.02 J4.4
  Bottom 0.203: v38.5,11 J2.20
21  (via drill 0.3)
  Top 0.203: v39.5,3 J1.21
  Odd 0.152: v39.5,3 39,3.5 39,24.5
  Odd 0.203: 39,24.5 19.19,44.31 J4.5
  Bottom 0.203: J2.21 v39.5,3
22  (via drill 0.3)
  Top 0.203: J1.22 v39.5,11
  Even 0.203: v39.5,11 39.5,25 20.4,44.1 20.4,47.6 20.4,48 20.4,50.06 J4.6
  Bottom 0.203: v39.5,11 J2.22
23  (via drill 0.3)
  Top 0.203: v40.5,3 J1.23
  Odd 0.152: v40.5,3 40,3.5 40,25.5
  Odd 0.203: 40,25.5 21.73,43.77 J4.7
  Bottom 0.203: J2.23 v40.5,3
24  (via drill 0.3)
  Top 0.203: J1.24 v40.5,11
  Even 0.203: v40.5,11 40.5,26 23,43.5 23,50 J4.8
  Bottom 0.203: v40.5,11 J2.24
25  (via drill 0.3)
  Top 0.203: v41.5,3 J1.25
  Odd 0.152: v41.5,3 41,3.5 41,26.5
  Odd 0.203: 41,26.5 24.27,43.23 J4.9
  Bottom 0.203: J2.25 v41.5,3
26  (via drill 0.3)
  Top 0.203: J1.26 v41.5,11
  Even 0.203: v41.5,11 41.5,27 25.5,43 25.5,50.04 J4.10
  Bottom 0.203: v41.5,11 J2.26
27  (via drill 0.3)
  Top 0.203: v42.5,3 J1.27
  Odd 0.152: v42.5,3 42,3.5 42,27.5
  Odd 0.203: 42,27.5 26.81,42.69 J4.11
  Bottom 0.203: J2.27 v42.5,3
28  (via drill 0.3)
  Top 0.203: J1.28 v42.5,11
  Even 0.203: v42.5,11 42.5,28 28.1,42.4 28.1,49.98 J4.12
  Bottom 0.203: v42.5,11 J2.28
29  (via drill 0.3)
  Top 0.203: v43.5,3 J1.29
  Odd 0.152: v43.5,3 43,3.5 43,28.5
  Odd 0.203: 43,28.5 29.35,42.15 J4.13
  Bottom 0.203: v43.5,3 J2.29
30  (via drill 0.3)
  Top 0.203: J1.30 v43.5,11
  Even 0.203: v43.5,11 43.5,29 30.6,41.9 30.6,50.02 J4.14
  Bottom 0.203: J2.30 v43.5,11 43.5,29.55 R29.1
31  (via drill 0.3)
  Top 0.203: v44.5,3 J1.31
  Odd 0.152: v44.5,3 44,3.5 44,29.5
  Odd 0.203: 44,29.5 31.89,41.61 J4.15
  Bottom 0.203: J2.31 v44.5,3
32  (via drill 0.3)
  Top 0.203: J1.32 v44.5,11
  Even 0.203: v44.5,11 44.5,30 33.1,41.4 33.1,50.06 J4.16
  Bottom 0.203: J2.32 v44.5,11 44.5,32.55 R28.1
33  (via drill 0.3)
  Top 0.203: v45.5,3 J1.33
  Odd 0.152: v45.5,3 46,3.5 46,29.5
  Odd 0.203: 46,29.5 59.11,42.61 J5.1
  Bottom 0.203: J2.33 v45.5,3
34  (via drill 0.3)
  Top 0.203: J1.34 v45.5,11
  Even 0.203: v45.5,11 45.5,30 57.9,42.4 57.9,50.06 J5.2
  Bottom 0.203: J2.34 v45.5,11 45.5,35.55 R27.1
35  (via drill 0.3)
  Top 0.203: v46.5,3 J1.35
  Odd 0.152: v46.5,3 47,3.5 47,28.5
  Odd 0.203: J5.3 61.65,43.15 47,28.5
  Bottom 0.203: J2.35 v46.5,3
36  (via drill 0.3)
  Top 0.203: J1.36 v46.5,11
  Even 0.203: v46.5,11 46.5,29 60.4,42.9 60.4,50.02 J5.4
  Bottom 0.203: J2.36 v46.5,11 46.5,38.55 R26.1
37  (via drill 0.3)
  Top 0.203: v47.5,3 J1.37
  Odd 0.152: v47.5,3 48,3.5 48,27.5
  Odd 0.203: 48,27.5 64.19,43.69 J5.5
  Bottom 0.203: J2.37 v47.5,3
38  (via drill 0.3)
  Top 0.203: J1.38 v47.5,11
  Even 0.203: v47.5,11 47.5,28 v51.75,32.25 62.9,43.4 62.9,49.98 J5.6
  Bottom 0.203: v47.5,11 J2.38 | v51.75,32.25 52,32.5 R30.2
39  (via drill 0.3)
  Top 0.203: v48.5,3 J1.39
  Odd 0.152: v48.5,3 49,3.5 49,26.5
  Odd 0.203: 49,26.5 66.73,44.23 J5.7
  Bottom 0.203: J2.39 v48.5,3
40  (via drill 0.3)
  Top 0.203: J1.40 v48.5,11
  Even 0.203: v48.5,11 48.5,27 65.5,44 65.5,50.04 J5.8
  Bottom 0.203: v48.5,11 J2.40
41  (via drill 0.3)
  Top 0.203: v49.5,3 J1.41
  Odd 0.152: v49.5,3 50,3.5 50,25.5
  Odd 0.203: 50,25.5 69.27,44.77 J5.9
  Bottom 0.203: J2.41 v49.5,3
42  (via drill 0.3)
  Top 0.203: J1.42 v49.5,11
  Even 0.203: v49.5,11 49.5,26 68,44.5 68,50 J5.10
  Bottom 0.203: v49.5,11 J2.42
43  (via drill 0.3)
  Top 0.203: v50.5,3 J1.43
  Odd 0.152: v50.5,3 51,3.5 51,24.5
  Odd 0.203: 51,24.5 71.81,45.31 J5.11
  Bottom 0.203: J2.43 v50.5,3
44  (via drill 0.3)
  Top 0.203: J1.44 v50.5,11
  Even 0.203: v50.5,11 50.5,25 70.5,45 70.5,49.96 J5.12
  Bottom 0.203: v50.5,11 J2.44
45  (via drill 0.3)
  Top 0.203: v51.5,3 J1.45
  Odd 0.152: v51.5,3 52,3.5 52,23.5
  Odd 0.203: 52,23.5 74.35,45.85 J5.13
  Bottom 0.203: J2.45 v51.5,3
46  (via drill 0.3)
  Top 0.203: J1.46 v51.5,11
  Even 0.203: v51.5,11 51.5,24 73,45.5 73,49.92 J5.14
  Bottom 0.203: v51.5,11 J2.46
47  (via drill 0.3)
  Top 0.203: v52.5,3 J1.47
  Odd 0.152: v52.5,3 53,3.5 53,22.5
  Odd 0.203: 53,22.5 76.89,46.39 J5.15
  Bottom 0.203: J2.47 v52.5,3
48  (via drill 0.3)
  Top 0.203: J1.48 v52.5,11
  Even 0.203: v52.5,11 52.5,23 75.6,46.1 75.6,49.98 J5.16
  Bottom 0.203: v52.5,11 J2.48
49  (via drill 0.3)
  Top 0.203: v53.5,3 J1.49
  Odd 0.152: v53.5,3 54,3.5 54,21.5
  Odd 0.203: 54,21.5 66.39,33.89 J6.1
  Bottom 0.203: J2.49 v53.5,3
50  (via drill 0.3)
  Top 0.203: J1.50 v53.5,11
  Even 0.203: J6.2 84.86,35.2 66.7,35.2 53.5,22 v53.5,11
  Bottom 0.203: v53.5,11 J2.50
51  (via drill 0.3)
  Top 0.203: v54.5,3 J1.51
  Odd 0.152: v54.5,3 55,3.5 55,20.5
  Odd 0.203: 55,20.5 65.85,31.35 J6.3
  Bottom 0.203: J2.51 v54.5,3
52  (via drill 0.3)
  Top 0.203: J1.52 v54.5,11
  Even 0.203: J6.4 84.92,32.6 66.1,32.6 54.5,21 v54.5,11
  Bottom 0.203: v54.5,11 J2.52
53  (via drill 0.3)
  Top 0.203: v55.5,3 J1.53
  Odd 0.152: v55.5,3 56,3.5 56,19.5
  Odd 0.203: 56,19.5 65.31,28.81 J6.5
  Bottom 0.203: J2.53 v55.5,3
54  (via drill 0.3)
  Top 0.203: J1.54 v55.5,11
  Even 0.203: J6.6 84.93,30.05 65.55,30.05 55.5,20 v55.5,11
  Bottom 0.203: v55.5,11 J2.54
55  (via drill 0.3)
  Top 0.203: v56.5,3 J1.55
  Odd 0.152: v56.5,3 57,3.5 57,18
  Odd 0.203: J6.7 65.27,26.27 57,18
  Bottom 0.203: J2.55 v56.5,3
56  (via drill 0.3)
  Top 0.203: J1.56 v56.5,11
  Even 0.203: J6.8 84.89,27.55 65.05,27.55 56.5,19 v56.5,11
  Bottom 0.203: v56.5,11 J2.56
57  (via drill 0.3)
  Top 0.203: v57.5,3 J1.57
  Odd 0.152: v57.5,3 58,3.5 58,16
  Odd 0.203: J6.9 65.73,23.73 58,16
  Bottom 0.203: J2.57 v57.5,3
58  (via drill 0.3)
  Top 0.203: J1.58 v57.5,11
  Even 0.203: J6.10 84.9,25 65.5,25 57.5,17 v57.5,11
  Bottom 0.203: v57.5,11 J2.58
59  (via drill 0.3)
  Top 0.203: v58.5,3 J1.59
  Odd 0.152: v58.5,3 59,3.5 59,14
  Odd 0.203: J6.11 66.19,21.19 59,14
  Bottom 0.203: J2.59 v58.5,3
60  (via drill 0.3)
  Top 0.203: J1.60 v58.5,11
  Top 0.406: v58.5,11 R16.1 61.95,14.05 71,5 TP7.1
  Even 0.203: J6.12 84.91,22.45 65.95,22.45 58.5,15 v58.5,11
  Bottom 0.203: v58.5,11 J2.60
61  (via drill 0.3)
  Top 0.203: v59.5,3 J1.61
  Odd 0.152: v59.5,3 60,3.5 60,12
  Odd 0.203: J6.13 66.65,18.65 60,12
  Bottom 0.203: J2.61 v59.5,3
62  (via drill 0.3, 0.6)
  Top 0.203: J1.62 v59.5,11
  Top 0.406: v64.25,17.75 66.95,15.05 R21.1 69.95,15.05 74,11 74,7 TP9.1
  Even 0.203: J6.14 84.92,19.9 66.4,19.9 v64.25,17.75 59.5,13 v59.5,11
  Bottom 0.203: v59.5,11 J2.62
63  (via drill 0.3)
  Top 0.203: v60.5,3 J1.63
  Odd 0.203: v60.5,3 61.5,3 64.5,6 64.5,13.5 67.11,16.11 J6.15
  Bottom 0.203: J2.63 v60.5,3
  Bottom 0.406: R33.1 65.09,5.04 J2.63
64  (via drill 0.3)
  Top 0.203: J1.64 v60.5,11
  Even 0.203: J6.16 84.93,17.35 66.85,17.35 v60.5,11
  Bottom 0.203: v60.5,11 J2.64
  Bottom 0.406: R34.1 65.01,8.96 J2.64
A1V5-
  Top 0.406: R17.1 R18.1 58.5,21.55 R16.2 63.05,15.95 69,10 TP8.1
A3V3-
  Top 0.406: R22.1 R23.1 67,18.95 68,17.95 R21.2 71.05,16.95 77,11 TP10.1
AGND  (via drill 0.3)
  Top 0.406: R19.2 56.85,31.1
  other vias: 66,4 68,4 70,8 70,12 68,12 66,12 66,8 69,30.7
  pour Top: 45.5,0 90,0 90,56 56,56 56,44.5 47.5,44.5 47.5,33.5 49.5,33.5 49.5,21 45.5,17
  pour Bottom: 45.5,0 90,0 90,56 56,56 56,38 49.5,31.5 49.5,21 45.5,17
  pour Odd: 45.5,0 90,0 90,56 56,56 56,38 49.5,31.5 49.5,21 45.5,17
  pour Even: 45.5,0 90,0 90,56 56,56 56,38 49.5,31.5 49.5,21 45.5,17
D1V5-
  Top 0.406: R13.1 R12.1 R11.2 24.95,15.95 TP6.1
D3V3-
  Top 0.406: R8.1 R7.1 R6.2 22.95,19.95 TP4.1
DGND  (via drill 0.3)  (20 unrouted)
  Bottom 0.203: J7.10 48.83,50 41.17,50 J7.2
  other vias: 24,4 22,4 20,6 22,8 20,12 22,12 20,30.7 43,32.5 24,8
  pour Top: 0,56 0,0 44.5,0 44.5,17.5 48.5,21.5 48.5,32.5 46.5,32.5 46.5,45.5 55,45.5 55,56
  pour Bottom: 0,56 0,0 44.5,0 44.5,17.5 48.5,21.5 48.5,32 55,38.5 55,56
  pour Odd: 0,56 0,0 44.5,0 44.5,17.5 48.5,21.5 48.5,32 55,38.5 55,56
  pour Even: 0,56 0,0 44.5,0 44.5,17.5 48.5,21.5 48.5,32 55,38.5 55,56
N$4
  Top 0.406: R7.2 32,25.95 R10.1
N$5
  Top 0.406: R8.2 R9.1
N$8
  Top 0.406: R12.2 42,25.95 R15.1
N$9
  Top 0.406: R18.2 R19.1
N$10
  Top 0.406: R17.2 52,25.95 R20.1
N$11
  Top 0.406: R22.2 62,25.95 R25.1
N$13
  Top 0.406: R2.2 22,25.95 R5.1
N$14
  Top 0.406: R3.2 R4.1
N$15
  Top 0.406: R13.2 R14.1
N$16
  Top 0.406: R23.2 R24.1
TCK  (via drill 0.3)
  Top 0.203: v43.5,43.5 39.92,47.08 J7.1
  Bottom 0.203: R26.2 44.68,41.95 44.68,42.32 v43.5,43.5
TDI
  Bottom 0.203: R29.2 38.05,47 48.37,47 J7.9
TDO  (via drill 0.3)
  Top 0.203: J7.3 43.5,47.67 v43.5,45
  Bottom 0.203: R27.2 43.5,44.45 v43.5,45
TMS  (via drill 0.3)
  Top 0.203: v45,46 J7.5
  Bottom 0.203: R28.2 37,44 39,46 v45,46
TRST
  Bottom 0.203: J7.8 47.54,51.54 49,53 51,53 52,52 R30.1
VSUP-
  Top 0.406: R2.1 R3.1 | R2.1 22.95,23 | TP2.1 12,30 14.95,27.05 R1.2 15,23.05 R2.1

### Text on the board
tPlace: 18 | 32 | 34 | 48 | DGND | AGND | 17 | 31 | 33 | 47 | + | - | 50 | VSUP | 49 | 15 | 63 | 1 | DGND | - | - | - | - | AGND | D3V3 | D1V5 | A1V5 | A3V3 | + | + | + | +
bPlace: Rev | Inspection module | for the Marmote platform | http://marmote.googlecode.com